# Altium schematic sheet 07_Buzzer.SchDoc: ECE315 Analog
size A; Date: 4/25/2017; ApprovedBy: JSK; CheckedBy: JSK; Author: JSK; CompanyName: University of Wisconsin; DrawnBy: JSK; Engineer: JSK; Organization: ECE 315; Address1: College of Engineering; Address2: 1415 Engineering Drive; Address3: Madison, WI 53706; Address4: ECE 315 Fall 2017; Revision: A; SheetNumber: 2; SheetTotal: 2; AssemblyNumber: 0; MachineName: ECE315-S19; PCBNumber: 001; ApprovedDate: 1/17/2019
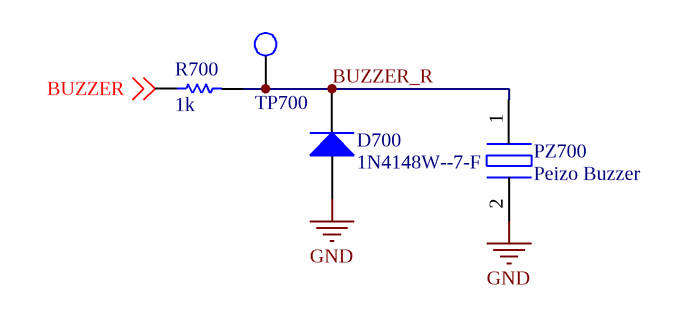
[diagram p0: 07_Buzzer.SchDoc]

## Parts
D700  Manufacturer Part Number: 1N4148W--7-F  [SOD323-12]  (hidden comment: DIODE_4148)
PZ700  Peizo Buzzer  [PKLCS]
R700  Resistance (Ohms): 1k  [RES_0805]  (hidden comment: RES_0805_K_001.00)
TP700  TP_1206  [TP-SMC-1206]  (value not drawn)

## Nets
GND: D700.2(A) PZ700.2(In)
BUZZER: R700.1 ; off-sheet BUZZER
BUZZER_R: D700.1(K) PZ700.1(In) R700.2 TP700.1

## Notes on the sheet
- Title:
- Size:
- A
- Machine:
- P.C. Board No:
- Assembly No:
- Rev:
- Sheet:
- of
- College of Engineering
- 1415 Engineering Drive
- Madison, WI 53706

## Library data of the parts
D700 = DIODE_4148: DIODE GEN PURP 100V 300MA SOD123; Manufacturer: Diodes; Diode Configuration: Single; Number of Elements per Chip: 1; Maximum Forward Voltage: 1.25V; Supplier 1: Digi-Key; Stock 1: 993734; Pricing 1: 1=0.18, 10=0.164, 100=0.0891, 500=0.0548, 1000=0.0374 (USD); Mounting Type: Surface Mount; Maximum Reverse Voltage: 100V; Package Type: SOD-123; Pin Count: 2; ComponentLink1URL: http://uk.rs-online.com/webdocs/0f8c/0900766b80f8c94e.pdf; ComponentLink1Description: http://uk.rs-online.com/webdocs/0f8c/0900766b80f8c94e.pdf; Supplier Part Number 1: 1N4148W-FDICT-ND
PZ700 = Peizo: AUDIO PIEZO TRANSDUCER 12.5V SMD; Manufacturer Part Number: PKLCS1212E2000-R1; Manufacturer: Murata Electronics North America; Voltage Range: 12.5V (Max); Sound Pressure Level: 70dB @ 1.5V, 10cm; Input Type: Zero-Peak Signal; Voltage - Rated: 1.5V; Driver Circuitry: Transducer, Externally Driven; Port Location: Side; Frequency: 2kHz; Operating Mode: Single Tone; Supplier: Digi-Key; RoHS: RoHS Compliant; Mounting Type: Surface Mount; Category: Audio Products; Termination: Solder Pads; Operating Temperature: -20°C ~ 70°C; Size / Dimension: 12.0mm L x 12.0mm W x 3.0mm H; Packaging: Cut Tape (CT); Technology: Piezo; Supplier Part Number: 490-5260-1-ND
R700 = RES_0805_K_001.00: RES SMD 1K OHM 1% 1/8W 0805; Manufacturer Part Number: ERJ-6ENF1001V; Manufacturer: Panasonic Electronic Components; Temperature Coefficient: ±100ppm/°C; Power (Watts): 0.125W, 1/8W; Failure Rate: -; Category: Resistors; Operating Temperature: -55°C ~ 155°C; RoHS: RoHS Compliant; Height - Seated (Max): 0.028" (0.70mm); Package / Case: 0805 (2012 Metric); Part Status: Active; Supplier: Digi-Key; Size / Dimension: 0.079" L x 0.049" W (2.00mm x 1.25mm); Composition: Thick Film; Features: Automotive AEC-Q200; Number of Terminations: 2; Tolerance: ±1%; Packaging: Cut Tape (CT); Supplier Device Package: 0805; Supplier Part Number: P1.00KCCT-ND
TP700 = TP_1206: Test Point SMD 1206; Manufacturer: TE Connectivity (Tyco Electronics); Manufacturer Part Number: 1625854-1; Resistance Value: 0 Ohm; Temperature Coefficient: N/R; Supplier 1: Digi-Key; Supplier Part Number 1: A106143CT-ND; Stock 1: 31937; Pricing 1: 1=0.28, 10=0.261, 25=0.224, 50=0.1902, 100=0.1828, 250=0.1641, 500=0.1567, 1000=0.1306 (USD); Case Size: 1206; Dimension: 3.2 x 1.6 x 1.25mm; Family: RC; Mounting: Surface Mount; Operating Temperature: -55 to 125 C; Part No: 1625854-1; RoHS: Yes; Packaging: Tape and Reel; Termination Style: N/R; Terminal Pitch: N/R; Power Rating: N/R; Tolerance: N/R; ComponentLink1URL: https://datasheet.ciiva.com/6439/eng-ds-1773266-a-6439169.pdf; ComponentLink1Description: https://datasheet.ciiva.com/6439/eng-ds-1773266-a-6439169.pdf; ComponentLink2URL: https://datasheet.ciiva.com/30136/1773266-a-30136341.pdf; ComponentLink2Description: https://datasheet.ciiva.com/30136/1773266-a-30136341.pdf; ComponentLink3URL: https://datasheet.ciiva.com/6439/eng-ds-1773266-a-6439080.pdf; ComponentLink3Description: https://datasheet.ciiva.com/6439/eng-ds-1773266-a-6439080.pdf; ComponentLink4URL: https://datasheet.ciiva.com/6439/eng-ds-1773266-a-6439081.pdf; ComponentLink4Description: https://datasheet.ciiva.com/6439/eng-ds-1773266-a-6439081.pdf; ComponentLink5URL: https://datasheet.ciiva.com/6439/eng-ds-1773266-a-6439083.pdf; ComponentLink5Description: https://datasheet.ciiva.com/6439/eng-ds-1773266-a-6439083.pdf